# EAGLE schematic control (EAGLE 7.4.0)
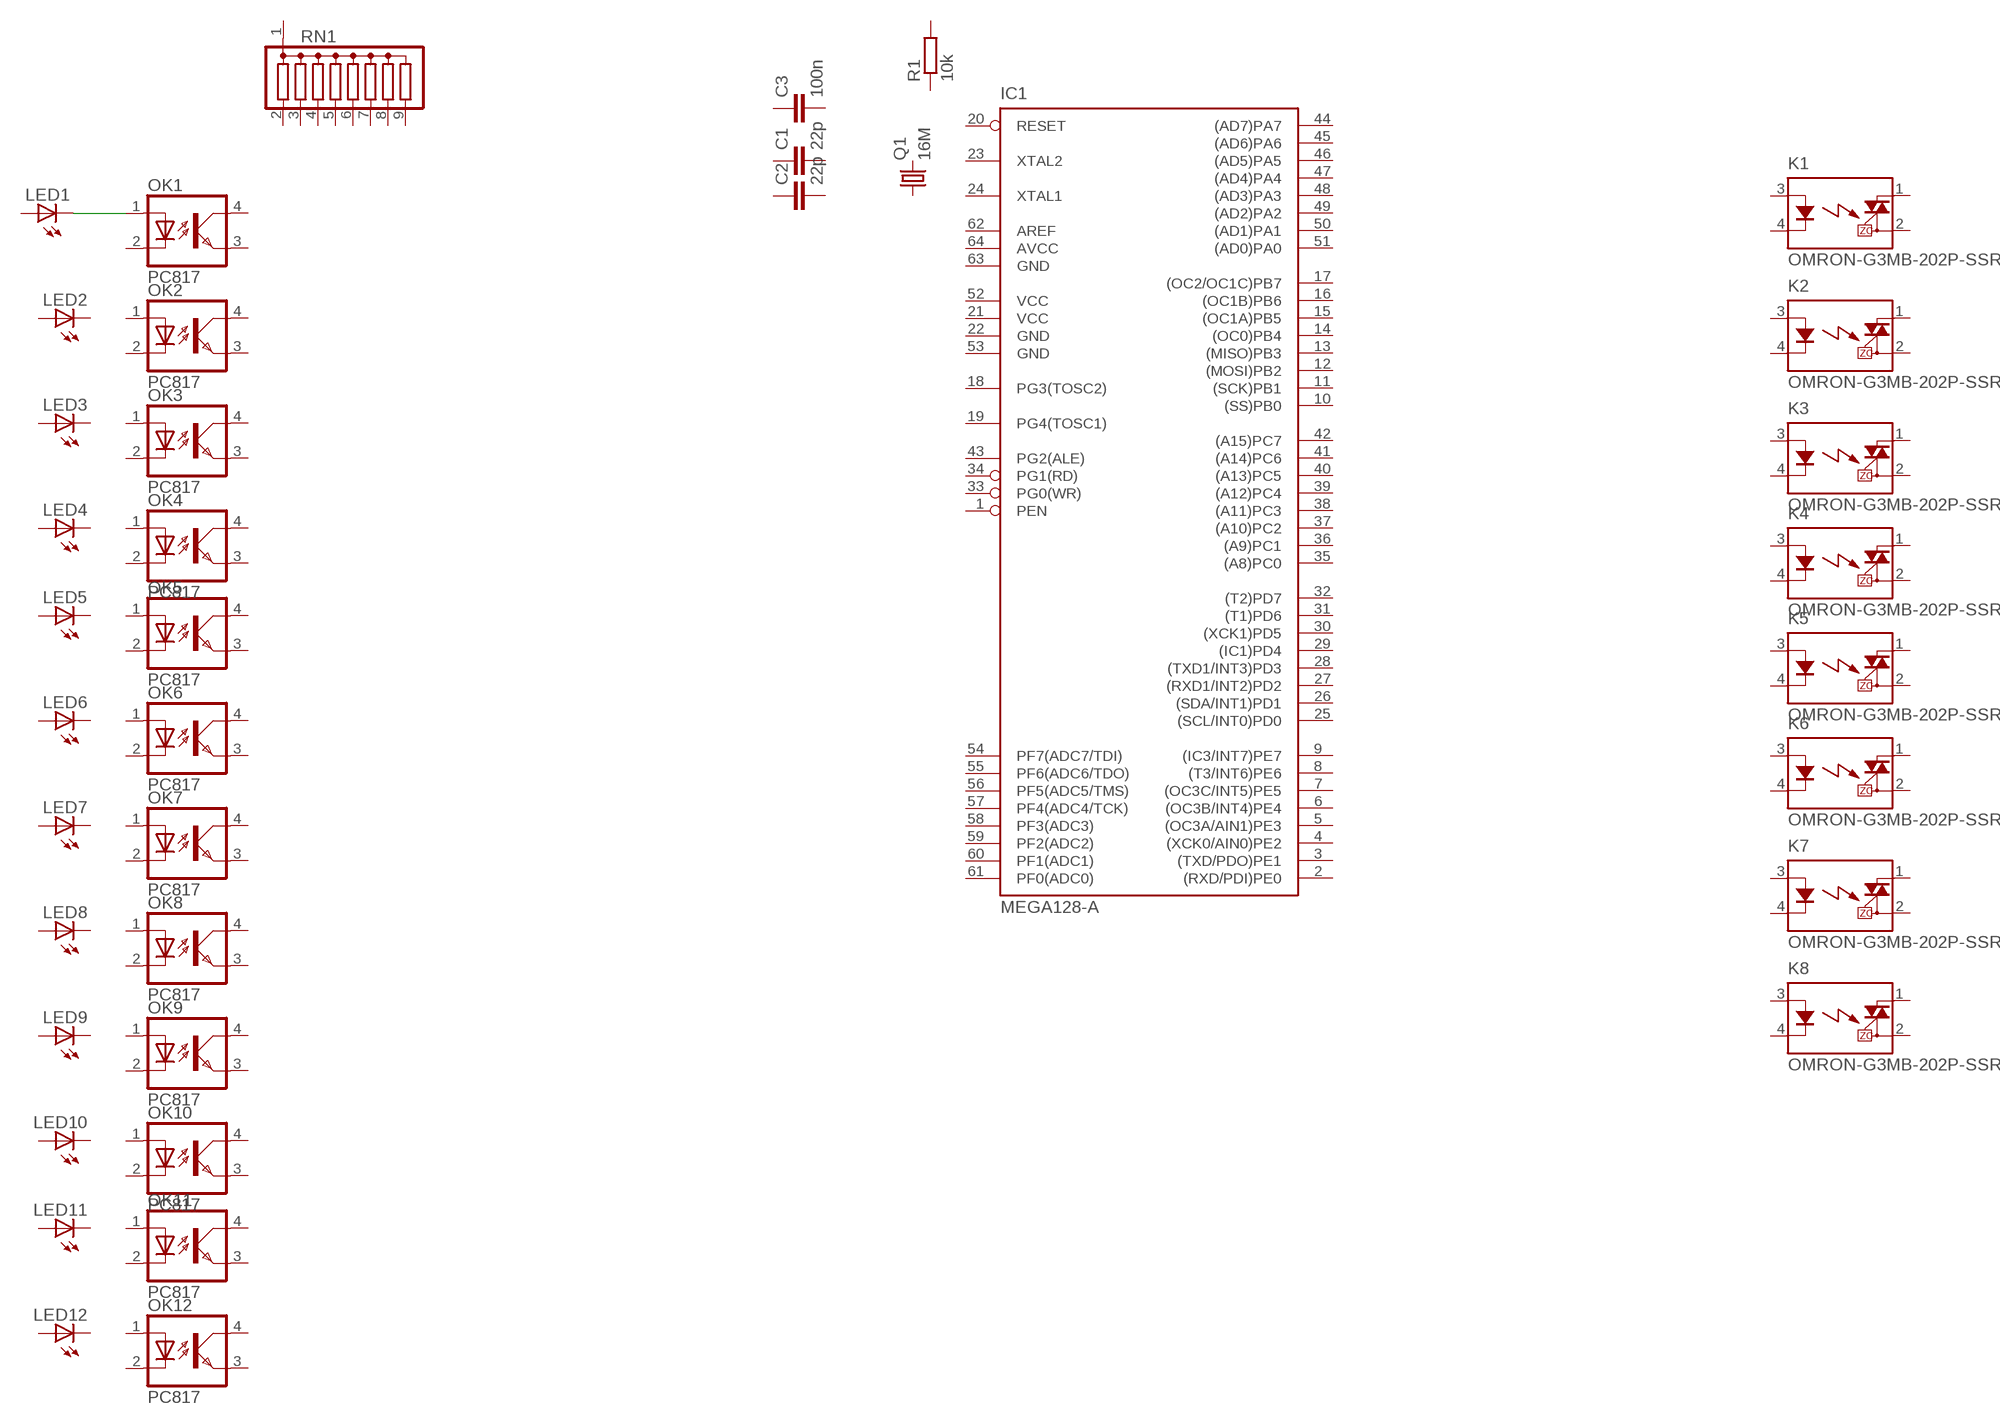
[diagram p0: schematic, sheet 1]

## Parts
C1  22p  C-EU025-025X050  [C025-025X050]
C2  22p  C-EU025-025X050  [C025-025X050]
C3  100n  C-EU025-025X050  [C025-025X050]
IC1  MEGA128-A  [TQFP64]
K1  OMRON-G3MB-202P-SSR2  [OMRON-G3MB-202P-SSR]
K2  OMRON-G3MB-202P-SSR2  [OMRON-G3MB-202P-SSR]
K3  OMRON-G3MB-202P-SSR2  [OMRON-G3MB-202P-SSR]
K4  OMRON-G3MB-202P-SSR2  [OMRON-G3MB-202P-SSR]
K5  OMRON-G3MB-202P-SSR2  [OMRON-G3MB-202P-SSR]
K6  OMRON-G3MB-202P-SSR2  [OMRON-G3MB-202P-SSR]
K7  OMRON-G3MB-202P-SSR2  [OMRON-G3MB-202P-SSR]
K8  OMRON-G3MB-202P-SSR2  [OMRON-G3MB-202P-SSR]
LED1  LED3MM  [LED3MM]
LED2  LED3MM  [LED3MM]
LED3  LED3MM  [LED3MM]
LED4  LED3MM  [LED3MM]
LED5  LED3MM  [LED3MM]
LED6  LED3MM  [LED3MM]
LED7  LED3MM  [LED3MM]
LED8  LED3MM  [LED3MM]
LED9  LED3MM  [LED3MM]
LED10  LED3MM  [LED3MM]
LED11  LED3MM  [LED3MM]
LED12  LED3MM  [LED3MM]
OK1  PC817  [DIL04]
OK2  PC817  [DIL04]
OK3  PC817  [DIL04]
OK4  PC817  [DIL04]
OK5  PC817  [DIL04]
OK6  PC817  [DIL04]
OK7  PC817  [DIL04]
OK8  PC817  [DIL04]
OK9  PC817  [DIL04]
OK10  PC817  [DIL04]
OK11  PC817  [DIL04]
OK12  PC817  [DIL04]
Q1  16M  CRYSTALHC49U-V  [HC49U-V]
R1  10k  R-EU_0207/10  [0207/10]
RN1  G08R  [SIL9]

## Nets
N$1: LED1.K(C) OK1.1(A)
Unconnected: C1.1 C1.2 C2.1 C2.2 C3.1 C3.2 IC1.1(PEN) IC1.2((RXD/PDI)PE0) IC1.3((TXD/PDO)PE1) IC1.4((XCK0/AIN0)PE2) IC1.5((OC3A/AIN1)PE3) IC1.6((OC3B/INT4)PE4) IC1.7((OC3C/INT5)PE5) IC1.8((T3/INT6)PE6) IC1.9((IC3/INT7)PE7) IC1.10((SS)PB0) IC1.11((SCK)PB1) IC1.12((MOSI)PB2) IC1.13((MISO)PB3) IC1.14((OC0)PB4) IC1.15((OC1A)PB5) IC1.16((OC1B)PB6) IC1.17((OC2/OC1C)PB7) IC1.18(PG3(TOSC2)) IC1.19(PG4(TOSC1)) IC1.20(RESET) IC1.23(XTAL2) IC1.24(XTAL1) IC1.25((SCL/INT0)PD0) IC1.26((SDA/INT1)PD1) IC1.27((RXD1/INT2)PD2) IC1.28((TXD1/INT3)PD3) IC1.29((IC1)PD4) IC1.30((XCK1)PD5) IC1.31((T1)PD6) IC1.32((T2)PD7) IC1.33(PG0(WR)) IC1.34(PG1(RD)) IC1.35((A8)PC0) IC1.36((A9)PC1) IC1.37((A10)PC2) IC1.38((A11)PC3) IC1.39((A12)PC4) IC1.40((A13)PC5) IC1.41((A14)PC6) IC1.42((A15)PC7) IC1.43(PG2(ALE)) IC1.44((AD7)PA7) IC1.45((AD6)PA6) IC1.46((AD5)PA5) IC1.47((AD4)PA4) IC1.48((AD3)PA3) IC1.49((AD2)PA2) IC1.50((AD1)PA1) IC1.51((AD0)PA0) IC1.54(PF7(ADC7/TDI)) IC1.55(PF6(ADC6/TDO)) IC1.56(PF5(ADC5/TMS)) IC1.57(PF4(ADC4/TCK)) IC1.58(PF3(ADC3)) IC1.59(PF2(ADC2)) IC1.60(PF1(ADC1)) IC1.61(PF0(ADC0)) IC1.62(AREF) K1.1(DS1) K1.2(DS2) K1.3(A) K1.4(K) K2.1(DS1) K2.2(DS2) K2.3(A) K2.4(K) K3.1(DS1) K3.2(DS2) K3.3(A) K3.4(K) K4.1(DS1) K4.2(DS2) K4.3(A) K4.4(K) K5.1(DS1) K5.2(DS2) K5.3(A) K5.4(K) K6.1(DS1) K6.2(DS2) K6.3(A) K6.4(K) K7.1(DS1) K7.2(DS2) K7.3(A) K7.4(K) K8.1(DS1) K8.2(DS2) K8.3(A) K8.4(K) LED1.A LED2.A LED2.K(C) LED3.A LED3.K(C) LED4.A LED4.K(C) LED5.A LED5.K(C) LED6.A LED6.K(C) LED7.A LED7.K(C) LED8.A LED8.K(C) LED9.A LED9.K(C) LED10.A LED10.K(C) LED11.A LED11.K(C) LED12.A LED12.K(C) OK1.2(C) OK1.3(EMIT) OK1.4(COL) OK2.1(A) OK2.2(C) OK2.3(EMIT) OK2.4(COL) OK3.1(A) OK3.2(C) OK3.3(EMIT) OK3.4(COL) OK4.1(A) OK4.2(C) OK4.3(EMIT) OK4.4(COL) OK5.1(A) OK5.2(C) OK5.3(EMIT) OK5.4(COL) OK6.1(A) OK6.2(C) OK6.3(EMIT) OK6.4(COL) OK7.1(A) OK7.2(C) OK7.3(EMIT) OK7.4(COL) OK8.1(A) OK8.2(C) OK8.3(EMIT) OK8.4(COL) OK9.1(A) OK9.2(C) OK9.3(EMIT) OK9.4(COL) OK10.1(A) OK10.2(C) OK10.3(EMIT) OK10.4(COL) OK11.1(A) OK11.2(C) OK11.3(EMIT) OK11.4(COL) OK12.1(A) OK12.2(C) OK12.3(EMIT) OK12.4(COL) Q1.1 Q1.2 R1.1 R1.2 RN1.1 RN1.2 RN1.3 RN1.4 RN1.5 RN1.6 RN1.7 RN1.8 RN1.9

## Power pins joined to a net without a drawn wire
AVCC: IC1.64(AVCC)
GND: IC1.22(GND) IC1.53(GND) IC1.63(GND)
VCC: IC1.21(VCC) IC1.52(VCC)

## Library data of the parts
C1-C3 = rcl:C-EU: CAPACITOR, European symbol
IC1 = atmel:MEGA128: MICROCONTROLLER 128 Kbytes FLASH 4 Kbytes SRAM 4 Kbytes EEPROM DUAL USART 8-channel 10 bit ADC Source: avr.lbr; MPN: ATMEGA128-16AU; OC_FARNELL: 9171118; OC_NEWARK: 95K7364
K1-K8 = ssr:OMRON-G3MB-202P-SSR: IT(rms) 8A, Zero Cross type SIP 4pin Triac output SSR Source: http://sharp-world.com/products/device/lineup/data/pdf/datasheet/s102s02_e.pdf; MPN: S202S02F; OC_FARNELL: 1618475; OC_NEWARK: 14N9588
LED1-LED12 = led:LED: LED OSRAM: - CHIPLED LG R971, LG N971, LY N971, LG Q971, LY Q971, LO R971, LY R971 LH N974, LH R974 LS Q976, LO Q976, LY Q976 LO Q996 - Hyper CHIPLED LW Q18S LB Q993, LB Q99A, LB R99A - SideLED LS A670, LO A670, LY A670, LG A670, LP A670 LB A673, LV A673, LT A673, LW A673 LH A674 LY A675 LS A676, LA A676, LO A676, LY A676, LW A676 LS A679, LY A679, LG A679 - Hyper Micro SIDELED® LS Y876, LA Y876, LO Y876, LY Y876 LT Y87S - SmartLED LW L88C, LW L88S LB L89C, LB L89S, LG L890 LS L89K, LO L89K, LY L89K LS L896, LA L896, LO L896, LY L896 - TOPLED LS T670, LO T670, LY T670, LG T670, LP T670 LSG T670, LSP T670, LSY T670, LOP T670, LYG T670 LG T671, LOG T671, LSG T671 LB T673, LV T673, LT T673, LW T673 LH T674 LS T676, LA T676, LO T676, LY T676, LB T676, LH T676, LSB T676, LW T676 LB T67C, LV T67C, LT T67C, LS T67K, LO T67K, LY T67K, LW E67C LS E67B, LA E67B, LO E67B, LY E67B, LB E67C, LV E67C, LT E67C LW T67C LS T679, LY T679, LG T679 LS T770, LO T770, LY T770, LG T770, LP T770 LB T773, LV T773, LT T773, LW T773 LH T774 LS E675, LA E675, LY E675, LS T675 LS T776, LA T776, LO T776, LY T776, LB T776 LHGB T686 LT T68C, LB T68C - Hyper Mini TOPLED® LB M676 - Mini TOPLED Santana® LG M470 LS M47K, LO M47K, LY M47K Source: http://www.osram.convergy.de LUXEON: - LUMILED® LXK2-PW12-R00, LXK2-PW12-S00, LXK2-PW14-U00, LXK2-PW14-V00 LXK2-PM12-R00, LXK2-PM12-S00, LXK2-PM14-U00 LXK2-PE12-Q00, LXK2-PE12-R00, LXK2-PE12-S00, LXK2-PE14-T00, LXK2-PE14-U00 LXK2-PB12-K00, LXK2-PB12-L00, LXK2-PB12-M00, LXK2-PB14-N00, LXK2-PB14-P00, LXK2-PB14-Q00 LXK2-PR12-L00, LXK2-PR12-M00, LXK2-PR14-Q00, LXK2-PR14-R00 LXK2-PD12-Q00, LXK2-PD12-R00, LXK2-PD12-S00 LXK2-PH12-R00, LXK2-PH12-S00 LXK2-PL12-P00, LXK2-PL12-Q00, LXK2-PL12-R00 Source: www.luxeon.com KINGBRIGHT: KA-3528ASYC Source: www.kingbright.com
OK1-OK12 = optocoupler:PC817: SHARP OPTO COUPLER; MPN: PC817X4J000F; OC_FARNELL: 9707727; OC_NEWARK: 97K7059
Q1 = crystal:CRYSTAL: CRYSTAL; OC_FARNELL: 1666969; OC_NEWARK: unknown
R1 = rcl:R-EU_: RESISTOR, European symbol
RN1 = resistor-sil:G08R: SIL RESISTOR; OC_FARNELL: unknown; OC_NEWARK: unknown